# Altium project PSLink_v1.PrjPcb (part 1 of 3)
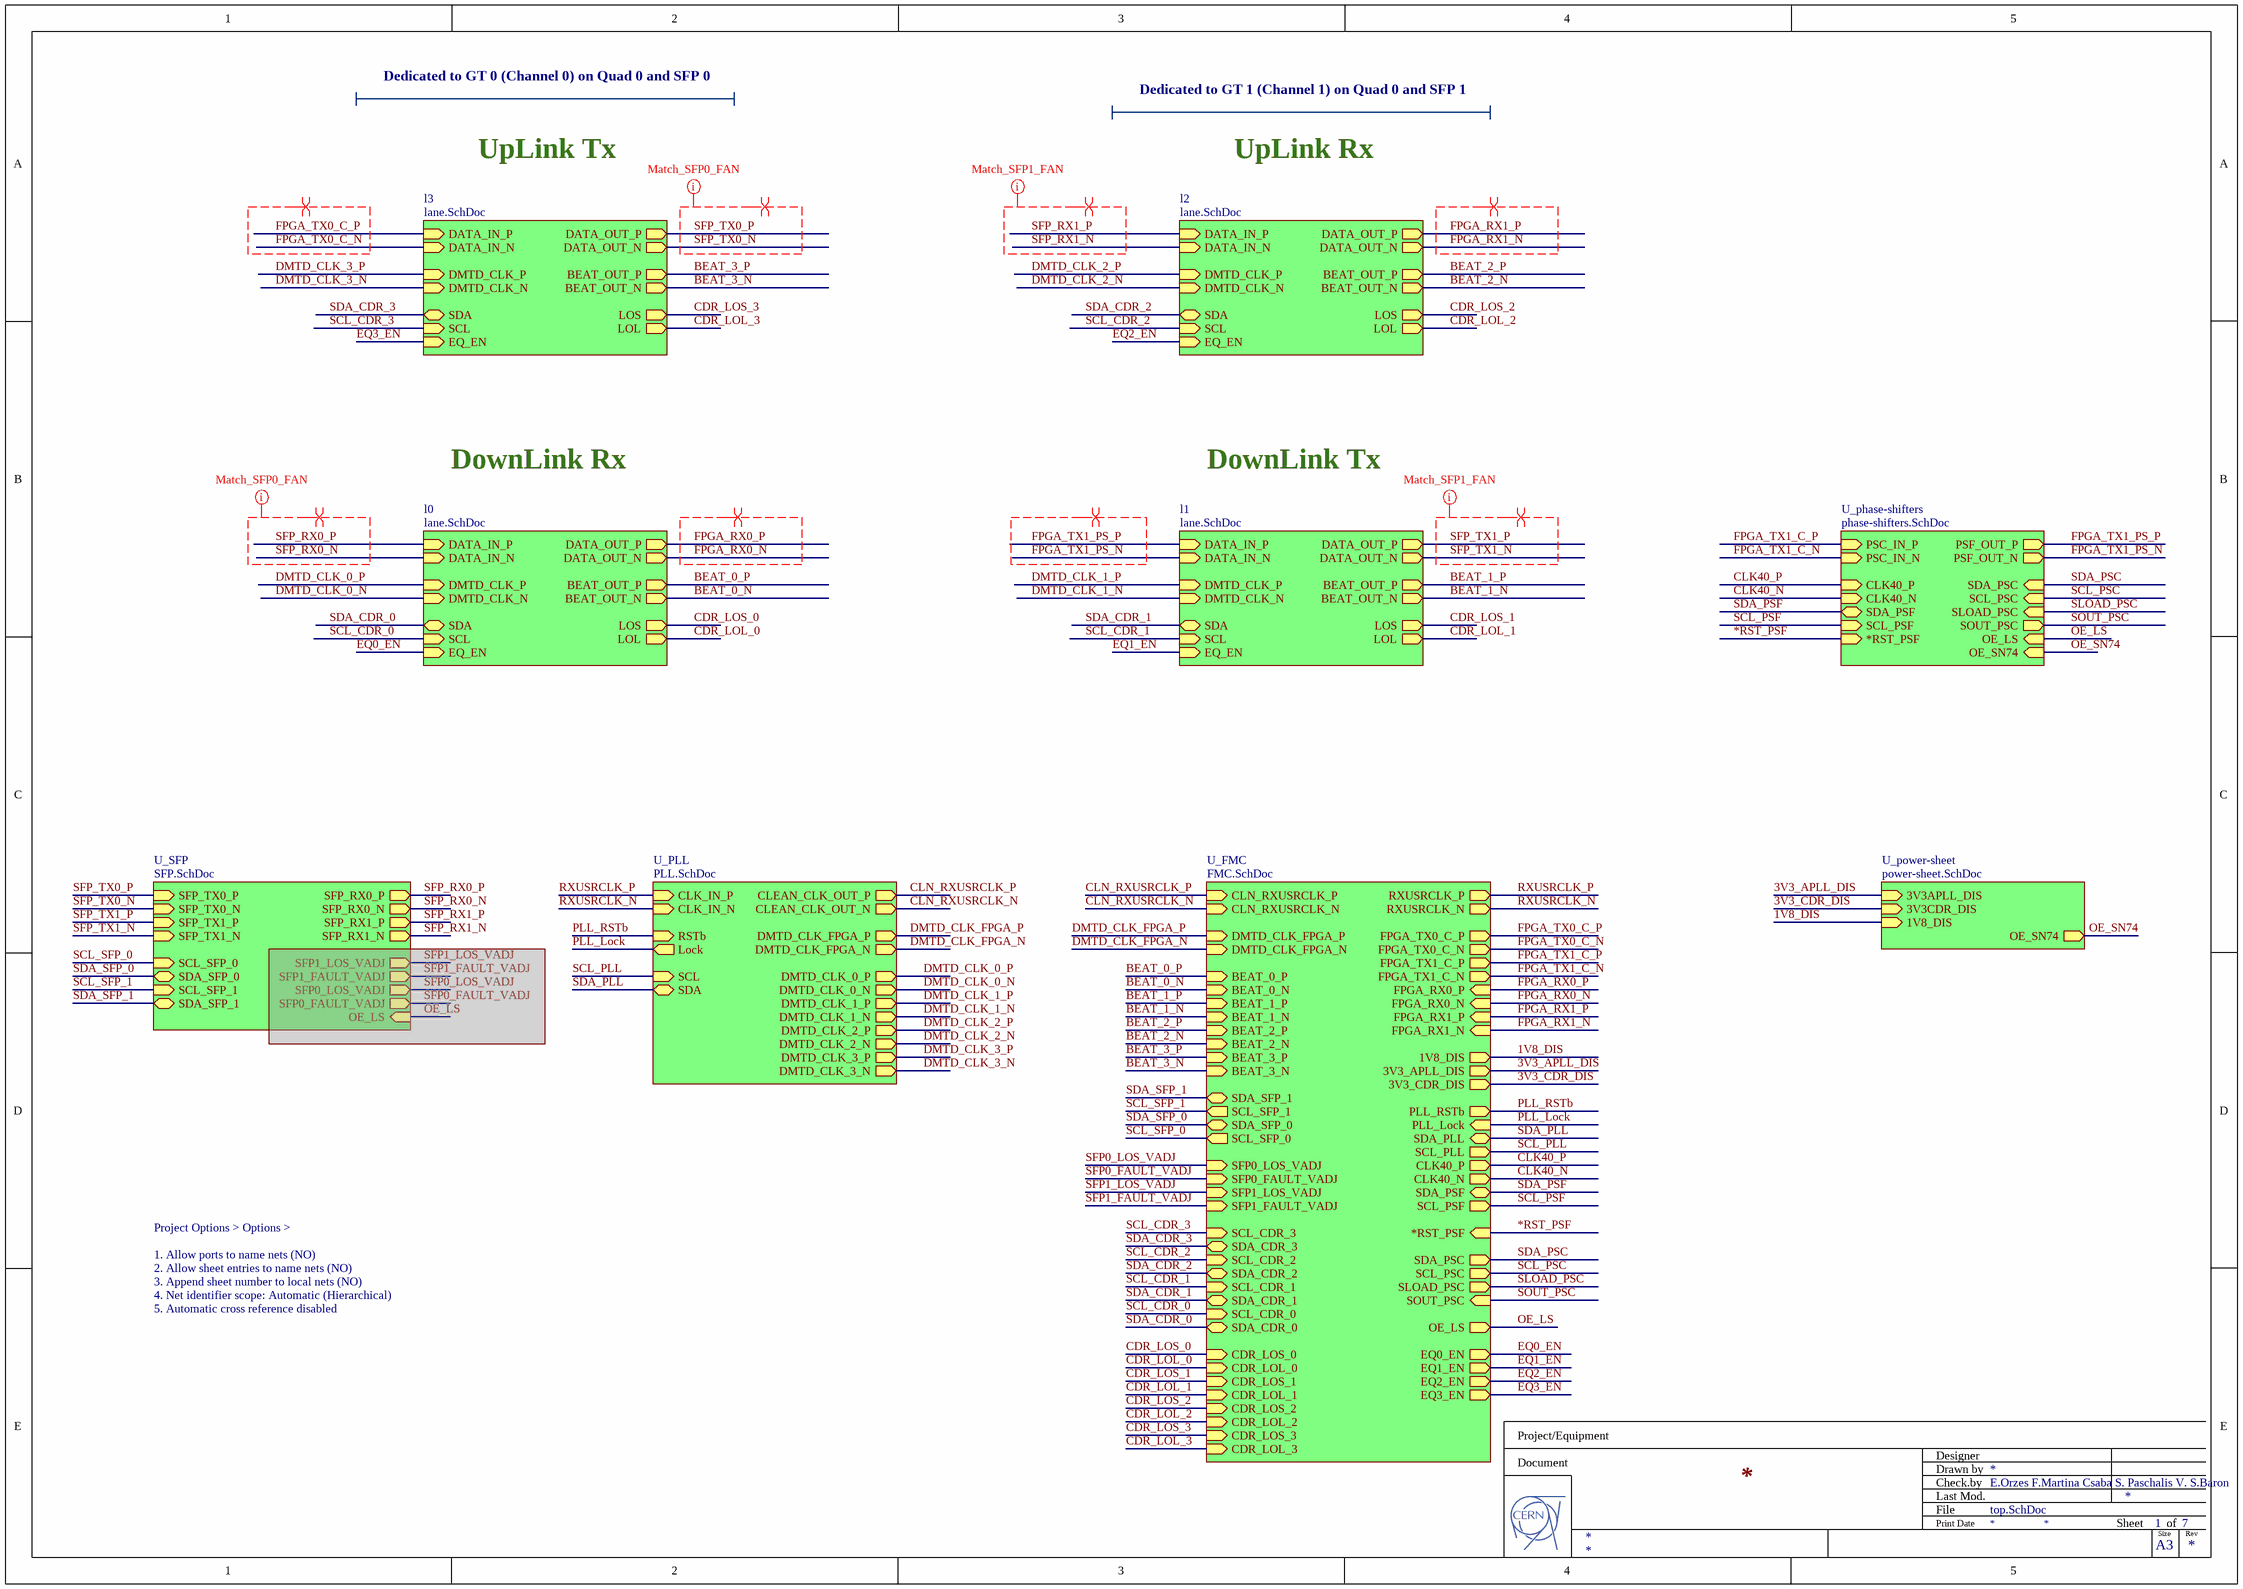
[diagram p0: top.SchDoc]
checkedby: E.Orzes F.Martina Csaba S. Paschalis V. S.Baron; Board_Revision: 1.0
7 sheets, 464 parts. Net scope: hierarchical (ports join the sheet entries above them; power ports are global).
Board file: PCB.PcbDoc
Sheets:
  top.SchDoc
    l3 = lane.SchDoc
    l2 = lane.SchDoc
    l1 = lane.SchDoc
    l0 = lane.SchDoc
    U_power-sheet = power-sheet.SchDoc
    U_phase-shifters = phase-shifters.SchDoc
    U_SFP = SFP.SchDoc
    U_PLL = PLL.SchDoc
    U_FMC = FMC.SchDoc

## Sheet top.SchDoc
size 420 x 297 mm; SheetNumber: 1; SheetTotal: 7

### Sub-sheets
l0 = lane.SchDoc: DATA_IN_P (in), DATA_IN_N (in), BEAT_OUT_P (out), BEAT_OUT_N (out), DMTD_CLK_P (in), DMTD_CLK_N (in), DATA_OUT_P (out), DATA_OUT_N (out), LOS (out), LOL (out), SDA (bidir), SCL (in), EQ_EN (in)
l1 = lane.SchDoc: DATA_IN_P (in), DATA_IN_N (in), BEAT_OUT_P (out), BEAT_OUT_N (out), DMTD_CLK_P (in), DMTD_CLK_N (in), DATA_OUT_P (out), DATA_OUT_N (out), LOS (out), LOL (out), SDA (bidir), SCL (in), EQ_EN (in)
l2 = lane.SchDoc: DATA_IN_P (in), DATA_IN_N (in), BEAT_OUT_P (out), BEAT_OUT_N (out), DMTD_CLK_P (in), DMTD_CLK_N (in), DATA_OUT_P (out), DATA_OUT_N (out), LOS (out), LOL (out), SDA (bidir), SCL (in), EQ_EN (in)
l3 = lane.SchDoc: DATA_IN_P (in), DATA_IN_N (in), BEAT_OUT_P (out), BEAT_OUT_N (out), DMTD_CLK_P (in), DMTD_CLK_N (in), DATA_OUT_P (out), DATA_OUT_N (out), LOS (out), LOL (out), SDA (bidir), SCL (in), EQ_EN (in)
U_FMC = FMC.SchDoc: DMTD_CLK_FPGA_N (in), DMTD_CLK_FPGA_P (in), BEAT_3_P (in), BEAT_3_N (in), SCL_PLL (out), SDA_PLL (bidir), SCL_SFP_1 (out), SDA_SFP_1 (bidir), SCL_SFP_0 (out), SDA_SFP_0 (bidir), PLL_Lock (in), SFP0_LOS_VADJ (in), SFP0_FAULT_VADJ (in), SFP1_LOS_VADJ (in), SFP1_FAULT_VADJ (in), CLN_RXUSRCLK_P (in), CLN_RXUSRCLK_N (in), RXUSRCLK_P (out), RXUSRCLK_N (out), PLL_RSTb (out), 1V8_DIS (out), 3V3_APLL_DIS (out), 3V3_CDR_DIS (out), FPGA_TX0_C_P (out), FPGA_TX0_C_N (out), FPGA_TX1_C_P (out), FPGA_TX1_C_N (out), FPGA_RX0_P (in), FPGA_RX0_N (in), FPGA_RX1_P (in), FPGA_RX1_N (in), BEAT_0_P (in), BEAT_0_N (in), BEAT_1_P (in), BEAT_1_N (in), BEAT_2_P (in), BEAT_2_N (in), CLK40_P (out), CLK40_N (out), SDA_PSF (bidir), SCL_PSF (out), CDR_LOS_1 (in), CDR_LOL_1 (in), CDR_LOS_0 (in), CDR_LOL_0 (in), CDR_LOS_3 (in), CDR_LOL_3 (in), CDR_LOS_2 (in), CDR_LOL_2 (in), *RST_PSF (in), SDA_PSC (out), SCL_PSC (out), SLOAD_PSC (out), SOUT_PSC (in), SCL_CDR_2 (in), SDA_CDR_2 (bidir), SCL_CDR_3 (in), SDA_CDR_3 (bidir), SDA_CDR_0 (bidir), SCL_CDR_1 (in), SDA_CDR_1 (bidir), SCL_CDR_0 (in), OE_LS (out), EQ0_EN (out), EQ1_EN (out), EQ2_EN (out), EQ3_EN (out)
U_phase-shifters = phase-shifters.SchDoc: PSC_IN_P (in), PSC_IN_N (in), PSF_OUT_P (out), PSF_OUT_N (out), CLK40_P (in), CLK40_N (in), SDA_PSF (bidir), SCL_PSF (in), *RST_PSF (in), SLOAD_PSC (in), SCL_PSC (in), SDA_PSC (in), SOUT_PSC (out), OE_LS (in), OE_SN74 (in)
U_PLL = PLL.SchDoc: SCL (in), SDA (bidir), CLK_IN_P (in), CLK_IN_N (in), CLEAN_CLK_OUT_P (out), CLEAN_CLK_OUT_N (out), DMTD_CLK_0_P (out), DMTD_CLK_0_N (out), DMTD_CLK_1_P (out), DMTD_CLK_1_N (out), DMTD_CLK_2_P (out), DMTD_CLK_2_N (out), DMTD_CLK_FPGA_P (out), DMTD_CLK_FPGA_N (out), DMTD_CLK_3_P (out), DMTD_CLK_3_N (out), Lock (out), RSTb (in)
U_power-sheet = power-sheet.SchDoc: 3V3APLL_DIS (in), 3V3CDR_DIS (in), 1V8_DIS (in), OE_SN74 (out)
U_SFP = SFP.SchDoc: SFP_RX0_P (out), SFP_RX0_N (out), SFP_TX0_P (in), SFP_TX0_N (in), SFP_RX1_P (out), SFP_RX1_N (out), SFP_TX1_P (in), SFP_TX1_N (in), SCL_SFP_0 (in), SDA_SFP_0 (bidir), SCL_SFP_1 (in), SDA_SFP_1 (bidir), SFP1_LOS_VADJ (out), SFP1_FAULT_VADJ (out), SFP0_LOS_VADJ (out), SFP0_FAULT_VADJ (out), OE_LS (in)

### Nets
1V8_DIS: sheet U_power-sheet/1V8_DIS, sheet U_FMC/1V8_DIS
3V3_APLL_DIS: sheet U_power-sheet/3V3APLL_DIS, sheet U_FMC/3V3_APLL_DIS
3V3_CDR_DIS: sheet U_power-sheet/3V3CDR_DIS, sheet U_FMC/3V3_CDR_DIS
*RST_PSF: sheet U_phase-shifters/*RST_PSF, sheet U_FMC/*RST_PSF
BEAT_0_N: sheet l0/BEAT_OUT_N, sheet U_FMC/BEAT_0_N
BEAT_0_P: sheet l0/BEAT_OUT_P, sheet U_FMC/BEAT_0_P
BEAT_1_N: sheet l1/BEAT_OUT_N, sheet U_FMC/BEAT_1_N
BEAT_1_P: sheet l1/BEAT_OUT_P, sheet U_FMC/BEAT_1_P
BEAT_2_N: sheet l2/BEAT_OUT_N, sheet U_FMC/BEAT_2_N
BEAT_2_P: sheet l2/BEAT_OUT_P, sheet U_FMC/BEAT_2_P
BEAT_3_N: sheet l3/BEAT_OUT_N, sheet U_FMC/BEAT_3_N
BEAT_3_P: sheet l3/BEAT_OUT_P, sheet U_FMC/BEAT_3_P
CDR_LOL_0: sheet l0/LOL, sheet U_FMC/CDR_LOL_0
CDR_LOL_1: sheet l1/LOL, sheet U_FMC/CDR_LOL_1
CDR_LOL_2: sheet l2/LOL, sheet U_FMC/CDR_LOL_2
CDR_LOL_3: sheet l3/LOL, sheet U_FMC/CDR_LOL_3
CDR_LOS_0: sheet l0/LOS, sheet U_FMC/CDR_LOS_0
CDR_LOS_1: sheet l1/LOS, sheet U_FMC/CDR_LOS_1
CDR_LOS_2: sheet l2/LOS, sheet U_FMC/CDR_LOS_2
CDR_LOS_3: sheet l3/LOS, sheet U_FMC/CDR_LOS_3
CLK40_N: sheet U_phase-shifters/CLK40_N, sheet U_FMC/CLK40_N
CLK40_P: sheet U_phase-shifters/CLK40_P, sheet U_FMC/CLK40_P
CLN_RXUSRCLK_N: sheet U_PLL/CLEAN_CLK_OUT_N, sheet U_FMC/CLN_RXUSRCLK_N
CLN_RXUSRCLK_P: sheet U_PLL/CLEAN_CLK_OUT_P, sheet U_FMC/CLN_RXUSRCLK_P
DMTD_CLK_0_N: sheet l0/DMTD_CLK_N, sheet U_PLL/DMTD_CLK_0_N
DMTD_CLK_0_P: sheet l0/DMTD_CLK_P, sheet U_PLL/DMTD_CLK_0_P
DMTD_CLK_1_N: sheet l1/DMTD_CLK_N, sheet U_PLL/DMTD_CLK_1_N
DMTD_CLK_1_P: sheet l1/DMTD_CLK_P, sheet U_PLL/DMTD_CLK_1_P
DMTD_CLK_2_N: sheet l2/DMTD_CLK_N, sheet U_PLL/DMTD_CLK_2_N
DMTD_CLK_2_P: sheet l2/DMTD_CLK_P, sheet U_PLL/DMTD_CLK_2_P
DMTD_CLK_3_N: sheet l3/DMTD_CLK_N, sheet U_PLL/DMTD_CLK_3_N
DMTD_CLK_3_P: sheet l3/DMTD_CLK_P, sheet U_PLL/DMTD_CLK_3_P
DMTD_CLK_FPGA_N: sheet U_PLL/DMTD_CLK_FPGA_N, sheet U_FMC/DMTD_CLK_FPGA_N
DMTD_CLK_FPGA_P: sheet U_PLL/DMTD_CLK_FPGA_P, sheet U_FMC/DMTD_CLK_FPGA_P
EQ0_EN: sheet l0/EQ_EN, sheet U_FMC/EQ0_EN
EQ1_EN: sheet l1/EQ_EN, sheet U_FMC/EQ1_EN
EQ2_EN: sheet l2/EQ_EN, sheet U_FMC/EQ2_EN
EQ3_EN: sheet l3/EQ_EN, sheet U_FMC/EQ3_EN
FPGA_RX0_N: sheet l0/DATA_OUT_N, sheet U_FMC/FPGA_RX0_N
FPGA_RX0_P: sheet l0/DATA_OUT_P, sheet U_FMC/FPGA_RX0_P
FPGA_RX1_N: sheet l2/DATA_OUT_N, sheet U_FMC/FPGA_RX1_N
FPGA_RX1_P: sheet l2/DATA_OUT_P, sheet U_FMC/FPGA_RX1_P
FPGA_TX0_C_N: sheet l3/DATA_IN_N, sheet U_FMC/FPGA_TX0_C_N
FPGA_TX0_C_P: sheet l3/DATA_IN_P, sheet U_FMC/FPGA_TX0_C_P
FPGA_TX1_C_N: sheet U_phase-shifters/PSC_IN_N, sheet U_FMC/FPGA_TX1_C_N
FPGA_TX1_C_P: sheet U_phase-shifters/PSC_IN_P, sheet U_FMC/FPGA_TX1_C_P
FPGA_TX1_PS_N: sheet l1/DATA_IN_N, sheet U_phase-shifters/PSF_OUT_N
FPGA_TX1_PS_P: sheet l1/DATA_IN_P, sheet U_phase-shifters/PSF_OUT_P
OE_LS: sheet U_phase-shifters/OE_LS, sheet U_FMC/OE_LS
OE_SN74: sheet U_power-sheet/OE_SN74, sheet U_phase-shifters/OE_SN74
PLL_Lock: sheet U_PLL/Lock, sheet U_FMC/PLL_Lock
PLL_RSTb: sheet U_PLL/RSTb, sheet U_FMC/PLL_RSTb
RXUSRCLK_N: sheet U_PLL/CLK_IN_N, sheet U_FMC/RXUSRCLK_N
RXUSRCLK_P: sheet U_PLL/CLK_IN_P, sheet U_FMC/RXUSRCLK_P
SCL_CDR_0: sheet l0/SCL, sheet U_FMC/SCL_CDR_0
SCL_CDR_1: sheet l1/SCL, sheet U_FMC/SCL_CDR_1
SCL_CDR_2: sheet l2/SCL, sheet U_FMC/SCL_CDR_2
SCL_CDR_3: sheet l3/SCL, sheet U_FMC/SCL_CDR_3
SCL_PLL: sheet U_PLL/SCL, sheet U_FMC/SCL_PLL
SCL_PSC: sheet U_phase-shifters/SCL_PSC, sheet U_FMC/SCL_PSC
SCL_PSF: sheet U_phase-shifters/SCL_PSF, sheet U_FMC/SCL_PSF
SCL_SFP_0: sheet U_SFP/SCL_SFP_0, sheet U_FMC/SCL_SFP_0  [project net SCL0]
SCL_SFP_1: sheet U_SFP/SCL_SFP_1, sheet U_FMC/SCL_SFP_1  [project net SCL1]
SDA_CDR_0: sheet l0/SDA, sheet U_FMC/SDA_CDR_0
SDA_CDR_1: sheet l1/SDA, sheet U_FMC/SDA_CDR_1
SDA_CDR_2: sheet l2/SDA, sheet U_FMC/SDA_CDR_2
SDA_CDR_3: sheet l3/SDA, sheet U_FMC/SDA_CDR_3
SDA_PLL: sheet U_PLL/SDA, sheet U_FMC/SDA_PLL
SDA_PSC: sheet U_phase-shifters/SDA_PSC, sheet U_FMC/SDA_PSC
SDA_PSF: sheet U_phase-shifters/SDA_PSF, sheet U_FMC/SDA_PSF
SDA_SFP_0: sheet U_SFP/SDA_SFP_0, sheet U_FMC/SDA_SFP_0  [project net SDA0]
SDA_SFP_1: sheet U_SFP/SDA_SFP_1, sheet U_FMC/SDA_SFP_1  [project net SDA1]
SFP0_FAULT_VADJ: sheet U_FMC/SFP0_FAULT_VADJ
SFP0_LOS_VADJ: sheet U_FMC/SFP0_LOS_VADJ
SFP1_FAULT_VADJ: sheet U_FMC/SFP1_FAULT_VADJ
SFP1_LOS_VADJ: sheet U_FMC/SFP1_LOS_VADJ
SFP_RX0_N: sheet l0/DATA_IN_N, sheet U_SFP/SFP_RX0_N
SFP_RX0_P: sheet l0/DATA_IN_P, sheet U_SFP/SFP_RX0_P
SFP_RX1_N: sheet l2/DATA_IN_N, sheet U_SFP/SFP_RX1_N
SFP_RX1_P: sheet l2/DATA_IN_P, sheet U_SFP/SFP_RX1_P
SFP_TX0_N: sheet l3/DATA_OUT_N, sheet U_SFP/SFP_TX0_N
SFP_TX0_P: sheet l3/DATA_OUT_P, sheet U_SFP/SFP_TX0_P
SFP_TX1_N: sheet l1/DATA_OUT_N, sheet U_SFP/SFP_TX1_N
SFP_TX1_P: sheet l1/DATA_OUT_P, sheet U_SFP/SFP_TX1_P
SLOAD_PSC: sheet U_phase-shifters/SLOAD_PSC, sheet U_FMC/SLOAD_PSC
SOUT_PSC: sheet U_phase-shifters/SOUT_PSC, sheet U_FMC/SOUT_PSC

### Layout directives
differential pair: FPGA_RX0_N, FPGA_RX0_P, FPGA_RX1_N, FPGA_RX1_P, FPGA_TX0_C_N, FPGA_TX0_C_P, FPGA_TX1_PS_N, FPGA_TX1_PS_P, SFP_RX0_N, SFP_RX0_P, SFP_RX1_N, SFP_RX1_P, SFP_TX0_N, SFP_TX0_P, SFP_TX1_N, SFP_TX1_P
net class Match_SFP0_FAN: SFP_RX0_N, SFP_RX0_P, SFP_TX0_N, SFP_TX0_P
net class Match_SFP1_FAN: SFP_RX1_N, SFP_RX1_P, SFP_TX1_N, SFP_TX1_P

### Notes on the sheet
- Dedicated to GT 0 (Channel 0) on Quad 0 and SFP 0
- Dedicated to GT 1 (Channel 1) on Quad 0 and SFP 1
- UpLink Tx
- UpLink Rx
- DownLink Rx
- DownLink Tx
- Project Options > Options >
  1. Allow ports to name nets (NO)
  2. Allow sheet entries to name nets (NO)
  3. Append sheet number to local nets (NO)
  4. Net identifier scope: Automatic (Hierarchical)
  5. Automatic cross reference disabled
- Project/Equipment
- Document
- Designer
- Drawn by
- Check.by
- File
- Last Mod.
- Print Date
- Sheet
- Size
- A3
- of
- Rev

## Sheet lane.SchDoc: Lane
size 420 x 297 mm; CheckedBy: E.Orzes F.Martina Csaba S. Paschalis V. S.Baron; CompanyName: CERN; DrawnBy: E.Orzes; Organization: CERN; Address1: European Organization for Nuclear Research; Address2: CH-1211 Genève 23 - Switzerland; Revision: 1.0; SheetNumber: 2; SheetTotal: 7; Projet: PSLink_t1; DivGrp: EP-ESE; Designer: E.Orzes; ModifiedDate: -
Used 4 times, as channels l3, l2, l1, l0. Parts and nets are listed once, with the designators drawn on the sheet.
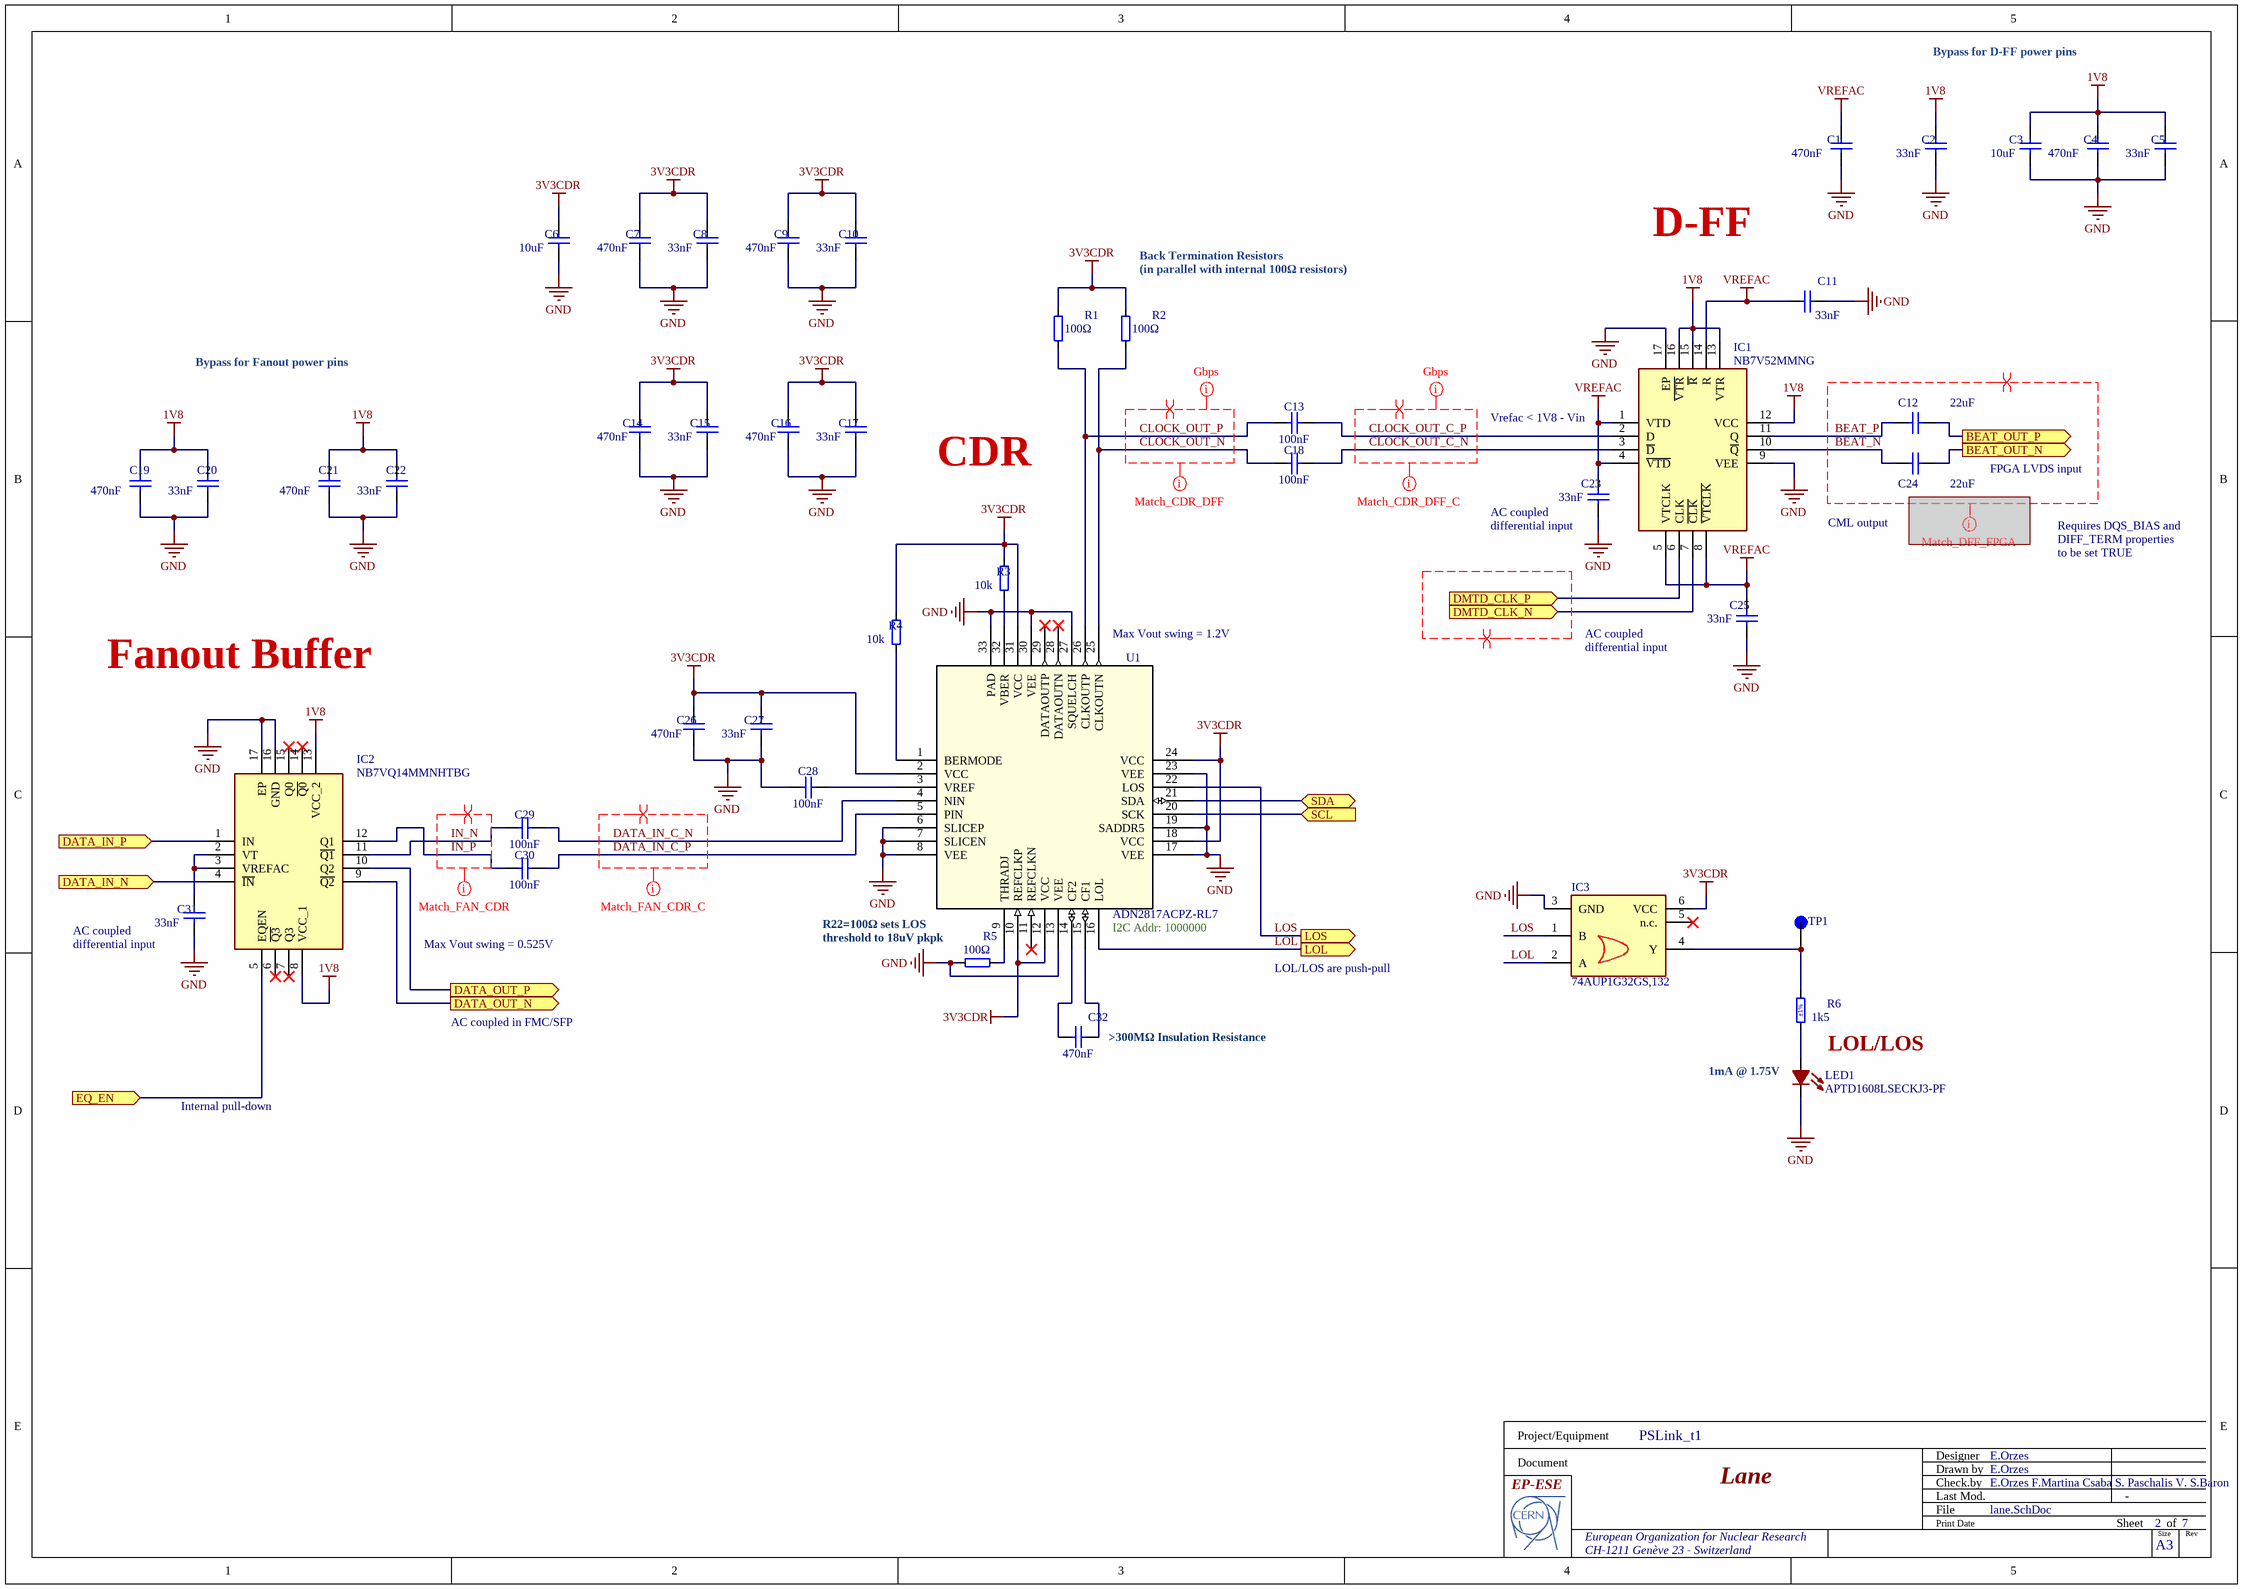
[diagram p1: lane.SchDoc]

### Parts
C1  470nF  [CAPC0510X04N]
C2  33nF  [LLL03TR61E333KE01]
C3  10uF  [CAPC1608X87N]
C4  470nF  [CAPC0510X04N]
C5  33nF  [LLL03TR61E333KE01]
C6  10uF  [CAPC1608X87N]
C7  470nF  [CAPC0510X04N]
C8  33nF  [LLL03TR61E333KE01]
C9  470nF  [CAPC0510X04N]
C10  33nF  [LLL03TR61E333KE01]
C11  33nF  [LLL03TR61E333KE01]
C12  22uF  [MURATA_HI_DENSITY_0402_CAP]
C13  100nF  [MURATA_HI_DENSITY_0201]
C14  470nF  [CAPC0510X04N]
C15  33nF  [LLL03TR61E333KE01]
C16  470nF  [CAPC0510X04N]
C17  33nF  [LLL03TR61E333KE01]
C18  100nF  [MURATA_HI_DENSITY_0201]
C19  470nF  [CAPC0510X04N]
C20  33nF  [LLL03TR61E333KE01]
C21  470nF  [CAPC0510X04N]
C22  33nF  [LLL03TR61E333KE01]
C23  33nF  [LLL03TR61E333KE01]
C24  22uF  [MURATA_HI_DENSITY_0402_CAP]
C25  33nF  [LLL03TR61E333KE01]
C26  470nF  [CAPC0510X04N]
C27  33nF  [LLL03TR61E333KE01]
C28  100nF  [MURATA_HI_DENSITY_0201]
C29  100nF  [MURATA_HI_DENSITY_0201]
C30  100nF  [MURATA_HI_DENSITY_0201]
C31  33nF  [LLL03TR61E333KE01]
C32  470nF  [CAPC2013X140N]
IC1  NB7V52MMNG  [QFN50P300X300X100-17N]
IC2  NB7VQ14MMNHTBG  [QFN50P300X300X100-17N]
IC3  74AUP1G32GS,132  [74LVC1G3157GS132]
LED1  APTD1608LSECKJ3-PF  [LED_APTD1608LSECKJ3-PF_KNB]
R1  100Ω  [MURATA_HI_DENSITY_0201]
R2  100Ω  [MURATA_HI_DENSITY_0201]
R3  10k  [MURATA_HI_DENSITY_0201]
R4  10k  [MURATA_HI_DENSITY_0201]
R5  100Ω  [MURATA_HI_DENSITY_0201]
R6  1k5  Tolerance: ±1%  [RESC1005X40N]
TP1  RCU-0C  [TP+195X110]  (value not drawn)
U1  ADN2817ACPZ-RL7  [CP_32_11_ADI]

### Ports
BEAT_OUT_N (out), BEAT_OUT_P (out), DATA_IN_N (in), DATA_IN_P (in), DATA_OUT_N (out), DATA_OUT_P (out), DMTD_CLK_N (in), DMTD_CLK_P (in), EQ_EN (in), LOL (out), LOS (out), SCL (in), SDA (bidir)

### Nets
1V8: C2.2 C3.2 C4.2 C5.2 C19.2 C20.2 C21.2 C22.2 IC1.12(VCC) IC1.13(VTR) IC1.15(~{R}) IC1.16(~{VTR}) IC2.8(VCC_1) IC2.13(VCC_2)
3V3CDR: C6.2 C7.2 C8.2 C9.2 C10.2 C14.2 C15.2 C16.2 C17.2 C26.2 C27.2 IC3.6(VCC) R1.2 R2.2 R3.2 R4.2 U1.2(VCC) U1.10(REFCLKP) U1.12(VCC) U1.18(VCC) U1.24(VCC) U1.31(VCC)
GND: C1.1 C2.1 C3.1 C4.1 C5.1 C6.1 C7.1 C8.1 C9.1 C10.1 C11.1 C14.1 C15.1 C16.1 C17.1 C19.1 C20.1 C21.1 C22.1 C23.1 C25.1 C26.1 C27.1 C28.1 C31.1 IC1.9(VEE) IC1.17(EP) IC2.16(GND) IC2.17(EP) IC3.3(GND) LED1.1(C) R5.1 U1.6(SLICEP) U1.7(SLICEN) U1.8(VEE) U1.13(VEE) U1.17(VEE) U1.19(SADDR5) U1.23(VEE) U1.27(SQUELCH) U1.30(VEE) U1.33(PAD)
VREFAC: C1.2 C11.2 C23.2 C25.2 IC1.1(VTD) IC1.4(~{VTD}) IC1.5(VTCLK) IC1.8(~{VTCLK}) IC1.14(R)
BEAT_N: C24.2 IC1.10(~{Q})
BEAT_OUT_N: C24.1 ; port BEAT_OUT_N
BEAT_OUT_P: C12.1 ; port BEAT_OUT_P
BEAT_P: C12.2 IC1.11(Q)
CLOCK_OUT_C_N: C18.2 IC1.3(~{D})
CLOCK_OUT_C_P: C13.2 IC1.2(D)
CLOCK_OUT_N: C18.1 R2.1 U1.25(CLKOUTN)
CLOCK_OUT_P: C13.1 R1.1 U1.26(CLKOUTP)
DATA_IN_C_N: C29.2 U1.4(NIN)
DATA_IN_C_P: C30.2 U1.5(PIN)
DATA_IN_N: IC2.4(~{IN}) ; port DATA_IN_N
DATA_IN_P: IC2.1(IN) ; port DATA_IN_P
DATA_OUT_N: IC2.9(~{Q2}) ; port DATA_OUT_N
DATA_OUT_P: IC2.10(Q2) ; port DATA_OUT_P
DMTD_CLK_N: IC1.7(~{CLK}) ; port DMTD_CLK_N
DMTD_CLK_P: IC1.6(CLK) ; port DMTD_CLK_P
EQ_EN: IC2.5(EQEN) ; port EQ_EN
IN_N: C29.1 IC2.11(~{Q1})
IN_P: C30.1 IC2.12(Q1)
LOL: IC3.2(A) U1.16(LOL) ; port LOL
LOS: IC3.1(B) U1.22(LOS) ; port LOS
SCL: U1.20(SCK) ; port SCL
SDA: U1.21(SDA) ; port SDA
NetC28_2: C28.2 U1.3(VREF)
NetC31_2: C31.2 IC2.2(VT) IC2.3(VREFAC)
NetC32_1: C32.1 U1.14(CF2)
NetC32_2: C32.2 U1.15(CF1)
NetIC3_4: IC3.4(Y) R6.2 TP1.1(TP)
NetLED1_2: LED1.2(A) R6.1
NetR3_1: R3.1 U1.32(VBER)
NetR4_1: R4.1 U1.1(BERMODE)
NetR5_2: R5.2 U1.9(THRADJ)

Not connected (* = marked no-connect by the designer): IC2 6(~{Q3})* 7(Q3)* 14(~{Q0})* 15(Q0)*; IC3 5(n.c.)*; U1 11(REFCLKN)* 28(DATAOUTN)* 29(DATAOUTP)*

### Channels
l3: designators end in _l3; ports BEAT_OUT_N=BEAT_3_N BEAT_OUT_P=BEAT_3_P DATA_IN_N=FPGA_TX0_C_N DATA_IN_P=FPGA_TX0_C_P DATA_OUT_N=SFP_TX0_N DATA_OUT_P=SFP_TX0_P DMTD_CLK_N=DMTD_CLK_3_N DMTD_CLK_P=DMTD_CLK_3_P EQ_EN=EQ3_EN LOL=CDR_LOL_3 LOS=CDR_LOS_3 SCL=SCL_CDR_3 SDA=SDA_CDR_3
l2: designators end in _l2; ports BEAT_OUT_N=BEAT_2_N BEAT_OUT_P=BEAT_2_P DATA_IN_N=SFP_RX1_N DATA_IN_P=SFP_RX1_P DATA_OUT_N=FPGA_RX1_N DATA_OUT_P=FPGA_RX1_P DMTD_CLK_N=DMTD_CLK_2_N DMTD_CLK_P=DMTD_CLK_2_P EQ_EN=EQ2_EN LOL=CDR_LOL_2 LOS=CDR_LOS_2 SCL=SCL_CDR_2 SDA=SDA_CDR_2
l1: designators end in _l1; ports BEAT_OUT_N=BEAT_1_N BEAT_OUT_P=BEAT_1_P DATA_IN_N=FPGA_TX1_PS_N DATA_IN_P=FPGA_TX1_PS_P DATA_OUT_N=SFP_TX1_N DATA_OUT_P=SFP_TX1_P DMTD_CLK_N=DMTD_CLK_1_N DMTD_CLK_P=DMTD_CLK_1_P EQ_EN=EQ1_EN LOL=CDR_LOL_1 LOS=CDR_LOS_1 SCL=SCL_CDR_1 SDA=SDA_CDR_1
l0: designators end in _l0; ports BEAT_OUT_N=BEAT_0_N BEAT_OUT_P=BEAT_0_P DATA_IN_N=SFP_RX0_N DATA_IN_P=SFP_RX0_P DATA_OUT_N=FPGA_RX0_N DATA_OUT_P=FPGA_RX0_P DMTD_CLK_N=DMTD_CLK_0_N DMTD_CLK_P=DMTD_CLK_0_P EQ_EN=EQ0_EN LOL=CDR_LOL_0 LOS=CDR_LOS_0 SCL=SCL_CDR_0 SDA=SDA_CDR_0

### Layout directives
differential pair: (no net found under the mark), BEAT_N, BEAT_P, CLOCK_OUT_C_N, CLOCK_OUT_C_P, CLOCK_OUT_N, CLOCK_OUT_P, DATA_IN_C_N, DATA_IN_C_P, IN_N, IN_P
net class Match_DFF_FPGA: BEAT_N, BEAT_P
mark named Gbps: CLOCK_OUT_C_N, CLOCK_OUT_C_P, CLOCK_OUT_N, CLOCK_OUT_P
net class Match_CDR_DFF: CLOCK_OUT_N, CLOCK_OUT_P
net class Match_FAN_CDR_C: DATA_IN_C_N, DATA_IN_C_P
net class Match_FAN_CDR: IN_N, IN_P
net class Match_CDR_DFF_C: CLOCK_OUT_C_N, CLOCK_OUT_C_P

### Notes on the sheet
- Bypass for D-FF power pins
- D-FF
- (near R2) Back Termination Resistors
  (in parallel with internal 100Ω resistors)
- Bypass for Fanout power pins
- Vrefac < 1V8 - Vin swing/2
- CDR
- (near C23) AC coupled
  differential input
- CML output
- FPGA LVDS input
- Requires DQS_BIAS and DIFF_TERM properties to be set TRUE
- (near U1) Max Vout swing = 1.2V
- AC coupled
  differential input
- Fanout Buffer
- (near U1) R22=100Ω sets LOS threshold to 18uV pkpk
- (near U1) I2C Addr: 1000000
- (near C31) AC coupled
  differential input
- Max Vout swing = 0.525V
- LOL/LOS are push-pull
- AC coupled in FMC/SFP
- (near C32) >300MΩ Insulation Resistance
- (near LED1) 1mA @ 1.75V
- LOL/LOS
- Internal pull-down
- Project/Equipment
- Document
- Designer
- Drawn by
- Check.by
- File
- Last Mod.
- Print Date
- Sheet
- Size
- A3
- of
- Rev

### Library data of the parts
C1 C4 C7 C9 C14 C16 C19 C21 C26 = Capacitor - non polarized: LLL153C70G474ME17; Value: 470nF
C2 C5 C8 C10 C11 C15 C17 C20 C22 C23 C25 C27 C31 = Capacitor - non polarized: LLL03TR61E333KE01; Value: 33nF
C3 C6 = CC0603_10UF_6.3V_20%_X5R: C1608X5R1E106M080AC; Part Description: SMD Multilayer Chip Ceramic Capacitor; Manufacturer: GENERIC; Manufacturer1 Part Number: C0603C106M9PAC; Voltage: 6.3V; TC: X5R; Tolerance: ±20%; Part Number: CC0603_10UF_6.3V_20%_X5R; Component Kind: Standard; Component Type: Standard; Pin Count: 2; Value: 10uF; Status: Preferred; Manufacturer Part Number: CC0603_10uF_6.3V_20%_X5R; Case: 0603; Mounted: Yes; Socket: No; SMD: Yes; Sense: No; Manufacturer1 Example: KEMET; Manufacturer1 ComponentHeight: 0.95mm; HelpURL: \\cern.ch\dfs\Applications\Altium\Datasheets\CC0603_X5R_KEMET.pdf; Author: CERN DEM JLC; CreateDate: 03/12/2007; LatestRevisionDate: 03/12/2007
C12 C24 = C0402-22uF-high-density: GRM155R60J226ME11; Vmax: 6.3V; Value: 22uF
C13 C18 C28-C30 = C0201-100nF-high-density: GRM033R61C104KE14; Vmax: 16V; Value: 100nF
C32 = CC0805_470NF_50V_10%_X7R_MURATA_GCM21BR71H474KA55L: GCM21BR71H474KA55L; Part Description: SMD Chip Monolithic Ceramic Capacitor for Automotive; Manufacturer: MURATA; Voltage: 50V; TC: X7R; Tolerance: ±10%; Part Number: CC0805_470NF_50V_10%_X7R_MURATA_GCM21BR71H474KA55L; Component Kind: Standard; Component Type: Standard; Pin Count: 2; Value: 470nF; Status: Not Recommended; Manufacturer Part Number: GCM21BR71H474KA55L; Case: 0805; Mounted: Yes; Socket: No; SMD: Yes; Sense: No; ComponentHeight: 1.4mm; HelpURL: \\cern.ch\dfs\Applications\Altium\Datasheets\CC0805_MURATA_GCM21BR71H474KA55L.pdf; Author: CERN DEM JLC; CreateDate: 5/10/2017; LatestRevisionDate: 5/10/2017
IC1 = NB7V52MMNG: Integrated Circuit; Manufacturer_Name: onsemi; Datasheet Link: https://www.onsemi.com/pdf/datasheet/nb7v52m-d.pdf; Height: 1mm; Manufacturer_Part_Number: NB7V52MMNG; Mouser Part Number: 863-NB7V52MMNG; Mouser Price/Stock: https://www.mouser.co.uk/ProductDetail/ON-Semiconductor/NB7V52MMNG?qs=N5dOQkml4H8i91m%252BmwlaUQ%3D%3D; Arrow Part Number: NB7V52MMNG; Arrow Price/Stock: https://www.arrow.com/en/products/nb7v52mmng/on-semiconductor
IC2 = NB7VQ14MMNHTBG: Integrated Circuit; Manufacturer_Name: onsemi; Datasheet Link: http://www.onsemi.com/pub/Collateral/NB7VQ14M-D.PDF; Height: 1mm; Manufacturer_Part_Number: NB7VQ14MMNHTBG; Mouser Part Number: 863-NB7VQ14MMNHTBG; Mouser Price/Stock: https://www.mouser.co.uk/ProductDetail/onsemi/NB7VQ14MMNHTBG?qs=3PKVEWFFm2%2FWq%2FFZ4xstfg%3D%3D; Arrow Part Number: NB7VQ14MMNHTBG; Arrow Price/Stock: https://www.arrow.com/en/products/nb7vq14mmnhtbg/on-semiconductor?utm_currency=USD&region=nac
IC3 = 74AUP1G32GS,132: Integrated Circuit; Manufacturer_Name: Nexperia; Datasheet Link: https://assets.nexperia.com/documents/data-sheet/74AUP1G32.pdf; Height: 0.35mm; Manufacturer_Part_Number: 74AUP1G32GS,132; Mouser Part Number: 771-74AUP1G32GS132; Mouser Price/Stock: https://www.mouser.com/Search/Refine.aspx?Keyword=771-74AUP1G32GS132
LED1 = APTD1608LSECKJ3-PF: Led Red 0603 2mA 1.8V 50mcd 84mW; Mfr_Name: Kingbright
R1 R2 R5 = R0201-100ohm-high-density: Resistor; Value: 100Ω
R3 R4 = R0201-100ohm-high-density: Resistor 10k; Value: 100Ω
R6 = R0402_1K5_1%_0.0625W_100PPM: Resistor - 1%; Part Description: General Purpose Thick Film Chip Resistor; Manufacturer: GENERIC; Manufacturer1 Part Number: 232270671502L; TC: ±100ppm/°C; PressFit: No; Part Number: R0402_1K5_1%_0.0625W_100PPM; Component Kind: Standard; Component Type: Standard; Pin Count: 2; Value: 1k5; Status: Not Recommended; Power: 0.0625W; Manufacturer Part Number: R0402_1K5_1%_0.0625W_100PPM; Case: 0402; Mounted: Yes; Sense: No; Socket: No; SMD: Yes; Manufacturer1 Example: YAGEO PHYCOMP; Manufacturer1 ComponentHeight: 0.4mm; HelpURL: \\cern.ch\dfs\Applications\Altium\Datasheets\R0402_Phycomp_RC0402.pdf; Author: CERN DEM JLC; CreateDate: 12/3/2007; LatestRevisionDate: 10/17/2012
TP1 = RCU-0C: MF: {'manufacturer': u'TE Connectivity AMP Connectors'}; Package: None; Price: None; Value: *; MP: RCU-0C; Availability: Unavailable
U1 = ADN2817ACPZ-RL7: CDR; Mfr_Name: Analog Devices Inc; RefDes: RefDes; Type: Type

## Sheet power-sheet.SchDoc: Power Regulator
size 420 x 297 mm; CheckedBy: E.Orzes F.Martina S.Baron; CompanyName: CERN; DrawnBy: E.Orzes; Organization: CERN; Address1: European Organization for Nuclear Research; Address2: CH-1211 Genève 23 - Switzerland; Revision: 1.0; SheetNumber: 7; SheetTotal: 7; Projet: Phase Stable Link; DivGrp: EP-ESE; Designer: E.Orzes; ModifiedDate: -
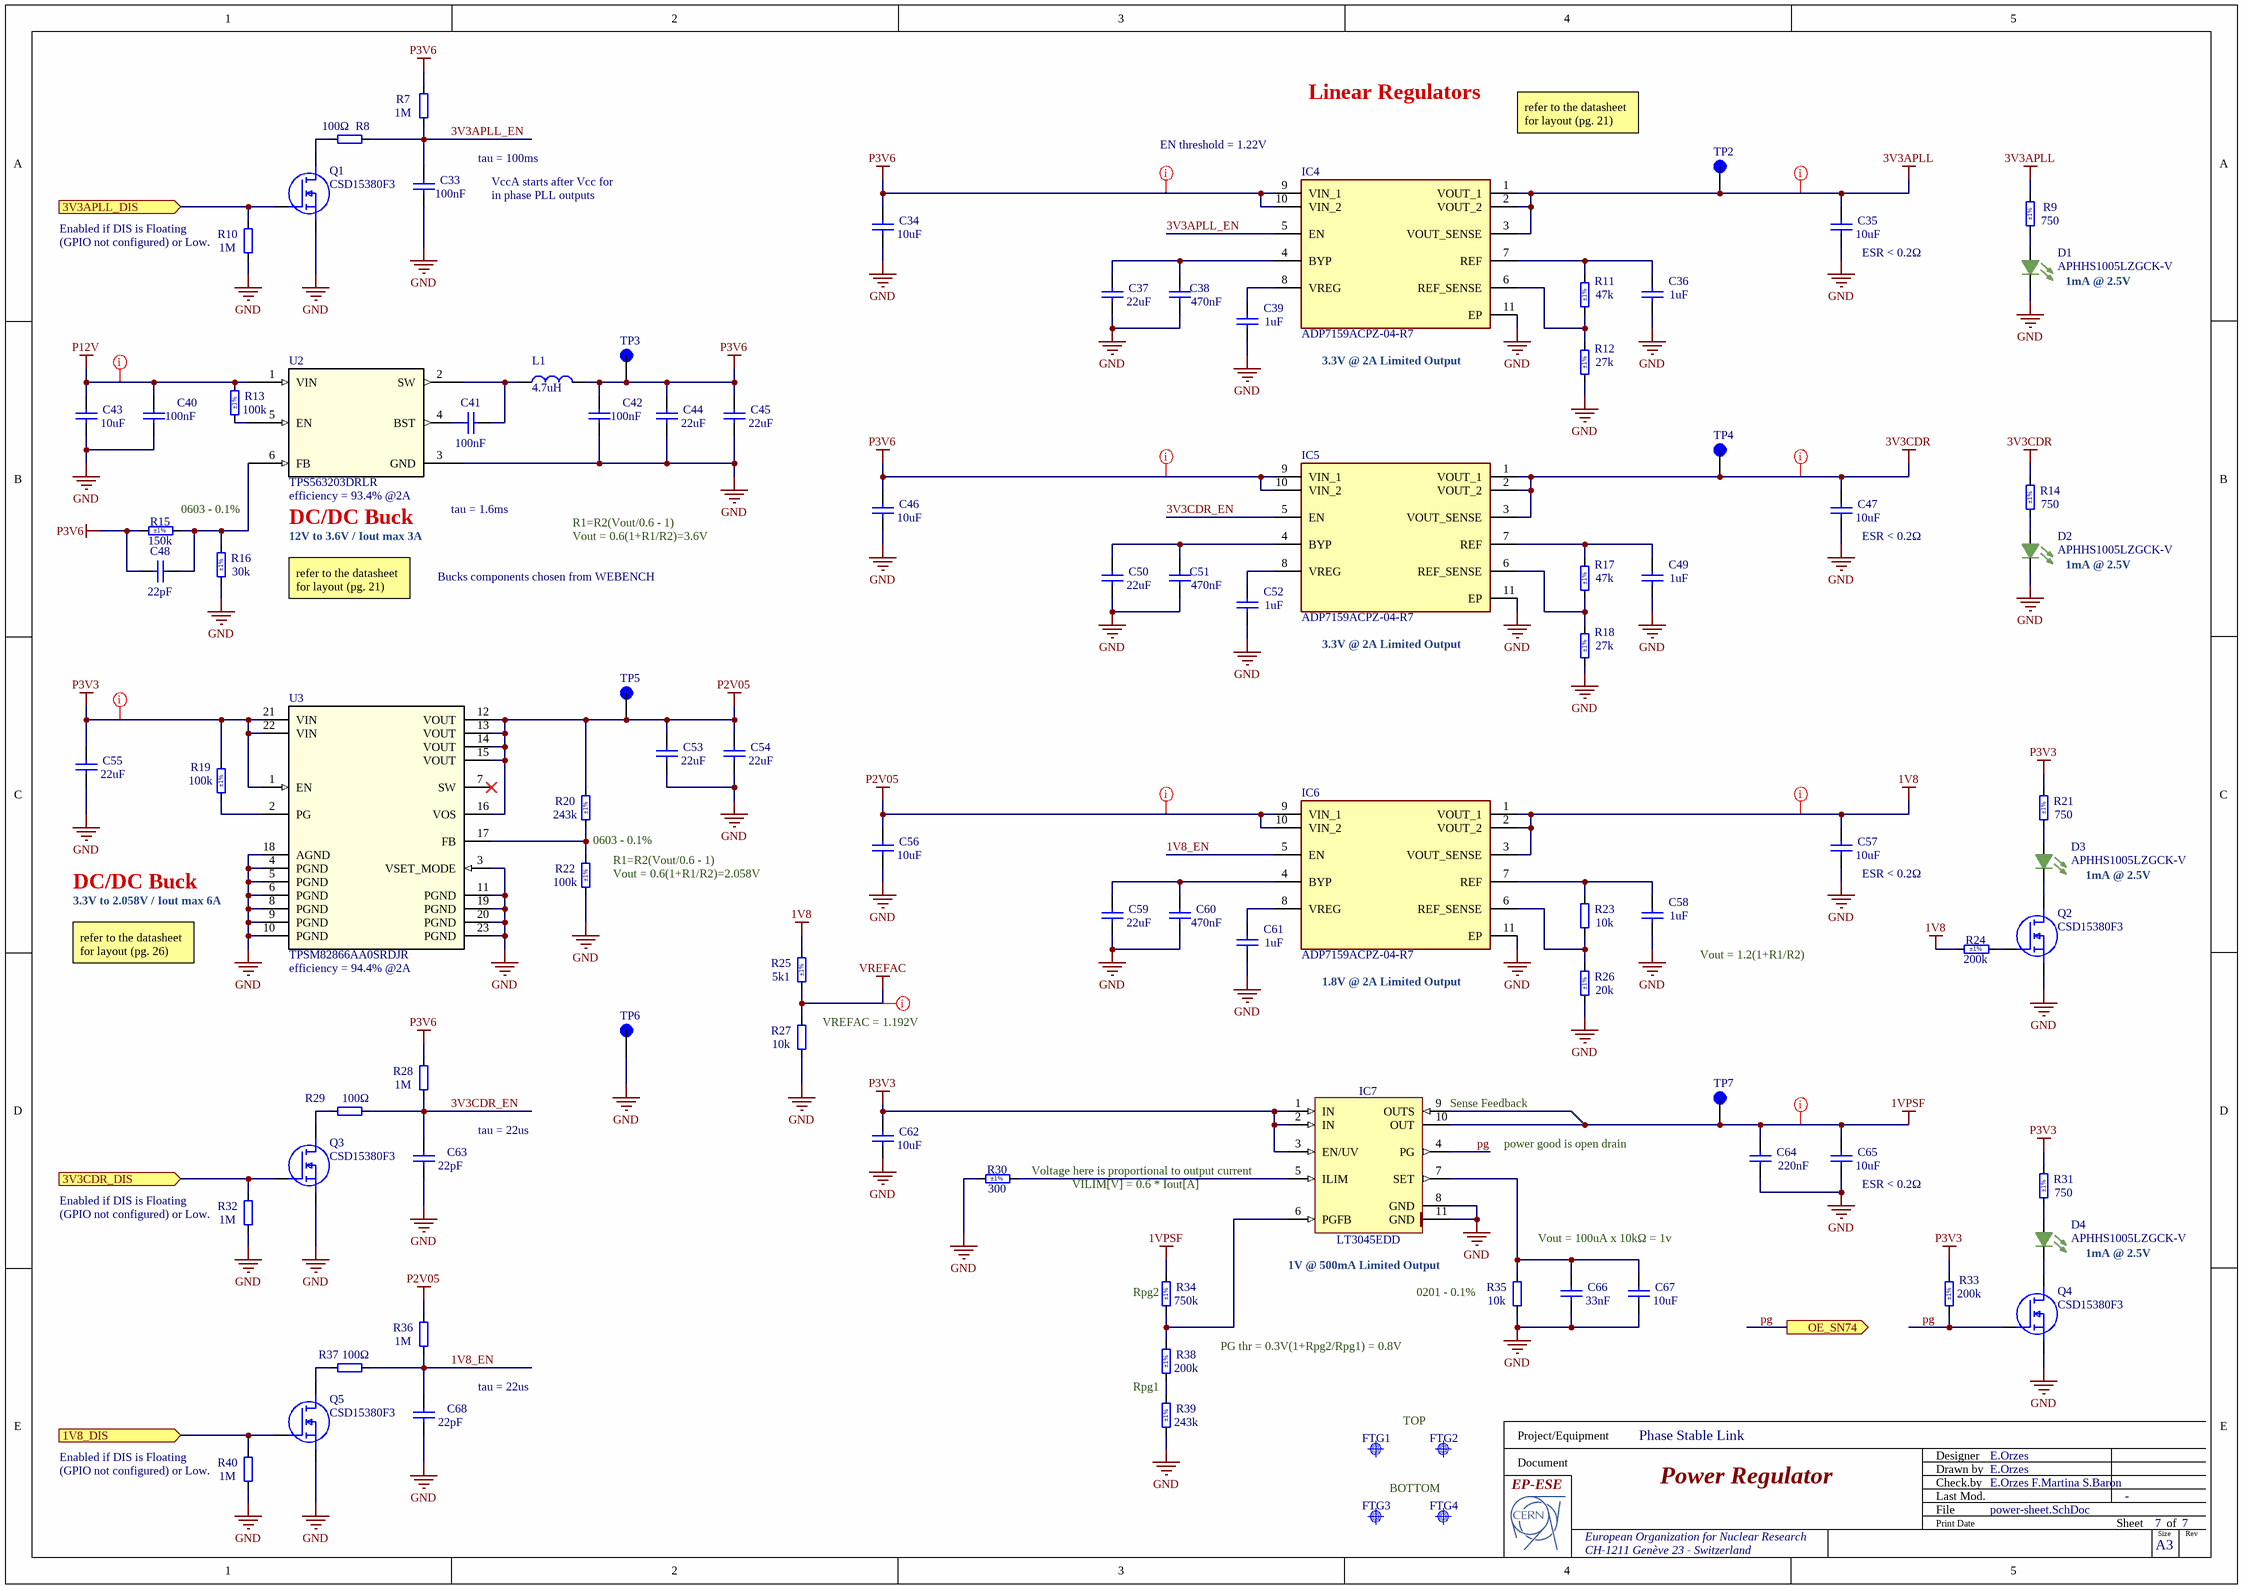
[diagram p2: power-sheet.SchDoc]

### Parts
(Parts that share a designator on the sheet are numbered #1, #2 ... from top to bottom, then left to right.)
C33  100nF  [MURATA_HI_DENSITY_0201]
C34  10uF  [CAPC1608X87N]
C35  10uF  [CAPC1608X87N]
C36  1uF  [CAPC1005X55N]
C37  22uF  [MURATA_HI_DENSITY_0402_CAP]
C38  470nF  [CAPC0510X04N]
C39  1uF  [CAPC1005X55N]
C40  100nF  [MURATA_HI_DENSITY_0402_CAP]
C41  100nF  [MURATA_HI_DENSITY_0402_CAP]
C42  100nF  [MURATA_HI_DENSITY_0402_CAP]
C43  10uF  [CAPC1608X87N]
C44  22uF  [MURATA_HI_DENSITY_0402_CAP]
C45  22uF  [MURATA_HI_DENSITY_0402_CAP]
C46  10uF  [CAPC1608X87N]
C47  10uF  [CAPC1608X87N]
C48  22pF  [MURATA_HI_DENSITY_0402_CAP]
C49  1uF  [CAPC1005X55N]
C50  22uF  [MURATA_HI_DENSITY_0402_CAP]
C51  470nF  [CAPC0510X04N]
C52  1uF  [CAPC1005X55N]
C53  22uF  [MURATA_HI_DENSITY_0402_CAP]
C54#1  22uF  [MURATA_HI_DENSITY_0402_CAP]
C55#1  22uF  [MURATA_HI_DENSITY_0402_CAP]
C56  10uF  [CAPC1608X87N]
C57  10uF  [CAPC1608X87N]
C58  1uF  [CAPC1005X55N]
C59  22uF  [MURATA_HI_DENSITY_0402_CAP]
C60  470nF  [CAPC0510X04N]
C61  1uF  [CAPC1005X55N]
C62  10uF  [CAPC1608X87N]
C63  22pF  [MURATA_HI_DENSITY_0402_CAP]
C64  220nF  [CAPC0603X33N]
C65  10uF  [CAPC1608X87N]
C66  33nF  [LLL03TR61E333KE01]
C67  10uF  [CAPC1608X87N]
C68  22pF  [MURATA_HI_DENSITY_0402_CAP]
D1  APHHS1005LZGCK-V  [LED_APHHS1005LZGCK-V]
D2  APHHS1005LZGCK-V  [LED_APHHS1005LZGCK-V]
D3  APHHS1005LZGCK-V  [LED_APHHS1005LZGCK-V]
D4  APHHS1005LZGCK-V  [LED_APHHS1005LZGCK-V]
FTG1  Use only in PCB  [FIDUCIAL_TOP_C100-200]  (value not drawn)
FTG2  Use only in PCB  [FIDUCIAL_TOP_C100-200]  (value not drawn)
FTG3  Use only in PCB  [FIDUCIAL_TOP_C100-200]  (value not drawn)
FTG4  Use only in PCB  [FIDUCIAL_TOP_C100-200]  (value not drawn)
IC4  ADP7159ACPZ-04-R7  [SON50P300X300X85-11N-D]
IC5  ADP7159ACPZ-04-R7  [SON50P300X300X85-11N-D]
IC6#1  ADP7159ACPZ-04-R7  [SON50P300X300X85-11N-D]
IC7  LT3045EDD  [SON50P300X300X80-11N-R175X248]
L1  4.7uH  [DFE322520FD1R0MP2]
Q1  CSD15380F3  [CSD15380F3]
Q2  CSD15380F3  [CSD15380F3]
Q3  CSD15380F3  [CSD15380F3]
Q4  CSD15380F3  [CSD15380F3]
Q5  CSD15380F3  [CSD15380F3]
R7  1M  [MURATA_HI_DENSITY_0201]
R8  100Ω  [MURATA_HI_DENSITY_0201]
R9  750  Tolerance: ±1%  [RESC1005X40N]
R10  1M  [MURATA_HI_DENSITY_0201]
R11  47k  Tolerance: ±1%  [RESC1005X40N]
R12  27k  Tolerance: ±1%  [RESC1005X40N]
R13  100k  Tolerance: ±1%  [RESC1608X55N]
R14  750  Tolerance: ±1%  [RESC1005X40N]
R15  150k  Tolerance: ±1%  [RESC1608X55N]
R16  30k  Tolerance: ±1%  [RESC1608X55N]
R17  47k  Tolerance: ±1%  [RESC1005X40N]
R18  27k  Tolerance: ±1%  [RESC1005X40N]
R19  100k  Tolerance: ±1%  [RESC1608X55N]
R20  243k  Tolerance: ±1%  [RESC1608X55N]
R21  750  Tolerance: ±1%  [RESC1005X40N]
R22  100k  Tolerance: ±1%  [RESC1608X55N]
R23  10k  [MURATA_HI_DENSITY_0201]
R24  200k  Tolerance: ±1%  [RESC1005X40N]
R25  5k1  Tolerance: ±1%  [RESC1005X40N]
R26  20k  Tolerance: ±1%  [RESC1005X40N]
R27  10k  [MURATA_HI_DENSITY_0201]
R28  1M  [MURATA_HI_DENSITY_0201]
R29  100Ω  [MURATA_HI_DENSITY_0201]
R30  300  Tolerance: ±1%  [RESC1005X40N]
R31  750  Tolerance: ±1%  [RESC1005X40N]
R32  1M  [MURATA_HI_DENSITY_0201]
R33  200k  Tolerance: ±1%  [RESC1005X40N]
R34  750k  Tolerance: ±1%  [RESC1005X40N]
R35  10k  [RESC0603X28N]
R36  1M  [MURATA_HI_DENSITY_0201]
R37  100Ω  [MURATA_HI_DENSITY_0201]
R38  200k  Tolerance: ±1%  [RESC1005X40N]
R39  243k  Tolerance: ±1%  [RESC1608X55N]
R40  1M  [MURATA_HI_DENSITY_0201]
TP2  RCU-0C  [TP+195X110]  (value not drawn)
TP3  RCU-0C  [TP+195X110]  (value not drawn)
TP4  RCU-0C  [TP+195X110]  (value not drawn)
TP5  RCU-0C  [TP+195X110]  (value not drawn)
TP6  RCU-0C  [TP+195X110]  (value not drawn)
TP7  RCU-0C  [TP+195X110]  (value not drawn)
U2  TPS563203DRLR  [SOT_07SDRLR_TEX]
U3  TPSM82866AA0SRDJR  [RDJ0023A-MFG]

### Ports
1V8_DIS (in), 3V3APLL_DIS (in), 3V3CDR_DIS (in), OE_SN74 (out)

### Nets
1V8: C57.2 IC6#1.1(VOUT_1) IC6#1.2(VOUT_2) IC6#1.3(VOUT_SENSE) R24.1 R25.2
1VPSF: C64.2 C65.2 IC7.9(OUTS) IC7.10(OUT) R34.2 TP7.1(TP)
3V3APLL: C35.2 IC4.1(VOUT_1) IC4.2(VOUT_2) IC4.3(VOUT_SENSE) R9.2 TP2.1(TP)
3V3CDR: C47.2 IC5.1(VOUT_1) IC5.2(VOUT_2) IC5.3(VOUT_SENSE) R14.2 TP4.1(TP)
GND: C33.1 C34.1 C35.1 C36.1 C37.1 C38.1 C39.1 C40.2 C42.2 C43.1 C44.1 C45.1 C46.1 C47.1 C49.1 C50.1 C51.1 C52.1 C53.1 C54#1.1 C55#1.1 C56.1 C57.1 C58.1 C59.1 C60.1 C61.1 C62.1 C63.2 C64.1 C65.1 C66.1 C67.1 C68.2 D1.1(C) D2.1(C) IC4.11(EP) IC5.11(EP) IC6#1.11(EP) IC7.8(GND) IC7.11(GND) Q1.2(S) Q2.2(S) Q3.2(S) Q4.2(S) Q5.2(S) R10.1 R12.1 R16.1 R18.1 R22.1 R26.1 R27.1 R30.1 R32.1 R35.1 R39.1 R40.1 TP6.1(TP) U2.3(GND) U3.3(VSET_MODE) U3.4(PGND) U3.5(PGND) U3.6(PGND) U3.8(PGND) U3.9(PGND) U3.10(PGND) U3.11(PGND) U3.18(AGND) U3.19(PGND) U3.20(PGND) U3.23(PGND)
P2V05: C53.2 C54#1.2 C56.2 IC6#1.9(VIN_1) IC6#1.10(VIN_2) R20.2 R36.2 TP5.1(TP) U3.12(VOUT) U3.13(VOUT) U3.14(VOUT) U3.15(VOUT) U3.16(VOS)
P3V3: C55#1.2 C62.2 IC7.1(IN) IC7.2(IN) IC7.3(EN/UV) R19.2 R21.2 R31.2 R33.2 U3.1(EN) U3.21(VIN) U3.22(VIN)
P3V6: C34.2 C42.1 C44.2 C45.2 C46.2 C48.2 IC4.9(VIN_1) IC4.10(VIN_2) IC5.9(VIN_1) IC5.10(VIN_2) L1.2 R7.2 R15.1 R28.2 TP3.1(TP)
P12V: C40.1 C43.2 R13.2 U2.1(VIN)
VREFAC: R25.1 R27.2
1V8_DIS: Q5.1(G) R40.2 ; port 1V8_DIS
1V8_EN: C68.1 IC6#1.5(EN) R36.1 R37.2
3V3_APLL_DIS: Q1.1(G) R10.2 ; port 3V3APLL_DIS
3V3_CDR_DIS: Q3.1(G) R32.2 ; port 3V3CDR_DIS
3V3APLL_EN: C33.2 IC4.5(EN) R7.1 R8.2
3V3CDR_EN: C63.1 IC5.5(EN) R28.1 R29.2
pg: IC7.4(PG) Q4.1(G) R33.1 ; port OE_SN74  [project net OE_SN74]
NetC36_2: C36.2 IC4.7(REF) R11.2
NetC37_2: C37.2 C38.2 IC4.4(BYP)
NetC39_2: C39.2 IC4.8(VREG)
NetC41_1: C41.1 L1.1 U2.2(SW)
NetC41_2: C41.2 U2.4(BST)
NetC48_1: C48.1 R15.2 R16.2 U2.6(FB)
NetC49_2: C49.2 IC5.7(REF) R17.2
NetC50_2: C50.2 C51.2 IC5.4(BYP)
NetC52_2: C52.2 IC5.8(VREG)
NetC58_2: C58.2 IC6#1.7(REF) R23.2
NetC59_2: C59.2 C60.2 IC6#1.4(BYP)
NetC61_2: C61.2 IC6#1.8(VREG)
NetC66_2: C66.2 C67.2 IC7.7(SET) R35.2
NetD1_2: D1.2(A) R9.1
NetD2_2: D2.2(A) R14.1
NetD3_1: D3.1(C) Q2.3(D)
NetD3_2: D3.2(A) R21.1
NetD4_1: D4.1(C) Q4.3(D)
NetD4_2: D4.2(A) R31.1
NetIC4_6: IC4.6(REF_SENSE) R11.1 R12.2
NetIC5_6: IC5.6(REF_SENSE) R17.1 R18.2
NetIC6#1_6: IC6#1.6(REF_SENSE) R23.1 R26.2
NetIC7_5: IC7.5(ILIM) R30.2
NetIC7_6: IC7.6(PGFB) R34.1 R38.2
NetQ1_3: Q1.3(D) R8.1
NetQ2_1: Q2.1(G) R24.2
NetQ3_3: Q3.3(D) R29.1
NetQ5_3: Q5.3(D) R37.1
NetR13_1: R13.1 U2.5(EN)
NetR19_1: R19.1 U3.2(PG)
NetR20_1: R20.1 R22.2 U3.17(FB)
NetR38_1: R38.1 R39.2

Not connected (* = marked no-connect by the designer): U3 7(SW)*

### Layout directives
net class Power: 1V8, 1VPSF, 3V3APLL, 3V3CDR, P2V05, P3V3, P3V6, P12V, VREFAC

### Notes on the sheet
- Linear Regulators
- refer to the datasheet for layout (pg. 21)
- tau = 100ms
- (near IC4) EN threshold = 1.22V
- (near R10) Enabled if DIS is Floating (GPIO not configured) or Low.
- VccA starts after Vcc for in phase PLL outputs
- (near C35) ESR < 0.2Ω
- 1mA @ 2.5V
- (near IC4) 3.3V @ 2A Limited Output
- (near R15) 0603 - 0.1%
- (near U2) DC/DC Buck
- (near U2) efficiency = 93.4% @2A
- (near U2) tau = 1.6ms
- R1=R2(Vout/0.6 - 1)
- 12V to 3.6V / Iout max 3A
- Bucks components chosen from WEBENCH
- Vout = 0.6(1+R1/R2)=3.6V
- (near C47) ESR < 0.2Ω
- (near IC5) 3.3V @ 2A Limited Output
- 0603 - 0.1%
- DC/DC Buck
- (near U3) 3.3V to 2.058V / Iout max 6A
- (near R22) Vout = 0.6(1+R1/R2)=2.058V
- (near C57) ESR < 0.2Ω
- refer to the datasheet for layout (pg. 26)
- (near U3) efficiency = 94.4% @2A
- (near IC6#1) 1.8V @ 2A Limited Output
- Vout = 1.2(1+R1/R2)
- (near R27) VREFAC = 1.192V
- tau = 22us
- (near IC7) Sense Feedback
- (near IC7) Voltage here is proportional to output current
- VILIM[V] = 0.6 * Iout[A]
- power good is open drain
- (near C65) ESR < 0.2Ω
- (near R32) Enabled if DIS is Floating (GPIO not configured) or Low.
- (near IC7) 1V @ 500mA Limited Output
- Vout = 100uA x 10kΩ = 1v
- (near R34) Rpg2
- (near R35) 0201 - 0.1%
- Rpg1
- PG thr = 0.3V(1+Rpg2/Rpg1) = 0.8V
- TOP
- (near R40) Enabled if DIS is Floating (GPIO not configured) or Low.
- BOTTOM
- Project/Equipment
- Document
- Designer
- Drawn by
- Check.by
- File
- Last Mod.
- Print Date
- Sheet
- Size
- A3
- of
- Rev

### Library data of the parts
C33 = C0201-100nF-high-density: GRM033R61C104KE14; Vmax: 16V; Value: 100nF
C34 C35 C43 C46 C47 C56 C57 C62 C65 C67 = CC0603_10UF_6.3V_20%_X5R: as C3 on sheet lane; Part Number: CC0603_10UF_6.3V_20%_X5R; Component Kind: Standard; Component Type: Standard; Pin Count: 2; Value: 10uF; Status: Preferred; Manufacturer Part Number: CC0603_10uF_6.3V_20%_X5R; Case: 0603; Mounted: Yes; Socket: No; SMD: Yes; Sense: No; Manufacturer1 Example: KEMET; Manufacturer1 ComponentHeight: 0.95mm; HelpURL: \\cern.ch\dfs\Applications\Altium\Datasheets\CC0603_X5R_KEMET.pdf; Author: CERN DEM JLC; CreateDate: 03/12/2007; LatestRevisionDate: 03/12/2007
C36 C39 C49 C52 C58 C61 = CC0402_1UF_16V_10%_X5R: GRM153B30J105ME15; Part Description: SMD Multilayer Chip Ceramic Capacitor; Manufacturer: GENERIC; Manufacturer1 Part Number: C1005X5R1C105KT; Voltage: 16V; TC: X5R; Tolerance: ±10%; Part Number: CC0402_1UF_16V_10%_X5R; Component Kind: Standard; Component Type: Standard; Pin Count: 2; Value: 1uF; Status: Preferred; Manufacturer Part Number: CC0402_1UF_16V_10%_X5R; Case: 0402; Mounted: Yes; Socket: No; SMD: Yes; Sense: No; Manufacturer1 Example: TDK; Manufacturer1 ComponentHeight: 0.55mm; HelpURL: \\cern.ch\dfs\Applications\Altium\Datasheets\CC0402_X5R_TDK_C.pdf; Author: CERN DEM JLC; CreateDate: 10/25/2012; LatestRevisionDate: 10/25/2012
C37 C44 C45 C50 C53 C54#1 C55#1 C59 = C0402-22uF-high-density: GRM155R60J226ME11; Vmax: 6.3V; Value: 22uF
C38 C51 C60 = Capacitor - non polarized: LLL153C70G474ME17; Value: 470nF
C40-C42 = C0402-22uF-high-density: GRM155R71E104KE14; Value: 22uF; Vmax: 6.3V
C48 C63 C68 = C0402-22uF-high-density: C0402C220J4GACTU; Value: 22uF; Vmax: 6.3V
C64 = CC0201_220NF_6.3V_10%_X7S_TDK_C0603X7S0J224K030: GRM033C80J224KE90D; Part Description: SMD Multilayer Chip Ceramic Capacitor; Manufacturer: TDK; Voltage: 6.3V; TC: X7S; Tolerance: ±10%; Part Number: CC0201_220NF_6.3V_10%_X7S_TDK_C0603X7S0J224K030; Component Kind: Standard; Component Type: Standard; Pin Count: 2; Value: 220nF; Status: Not Recommended; Manufacturer Part Number: C0603X7S0J224K030; Case: 0201; Mounted: Yes; Socket: No; SMD: Yes; Sense: No; ComponentHeight: 0.33mm; HelpURL: \\cern.ch\dfs\Applications\Altium\Datasheets\CC0201_X7S_TDK_C.pdf; Author: CERN DEM BC; CreateDate: 11/25/2020; LatestRevisionDate: 11/25/2020
C66 = Capacitor - non polarized: LLL03TR61E333KE01; Value: 33nF
D1-D4 = APHHS1005LZGCK-V: Led Green 0402 2mA 2.65V 40mcd 102mW; MF: Kingbright Corporation; SnapEDA_Link: https://www.snapeda.com/parts/APHHS1005LZGCK-V/Kingbright/view-part/?ref=snap; Package: 0402 Kingbright Corporation; Value: *; MP: APHHS1005LZGCK-V; Check_prices: https://www.snapeda.com/parts/APHHS1005LZGCK-V/Kingbright/view-part/?ref=eda
FTG1-FTG4 = FIDUCIAL_TARGET_C100-200: Fiducial Target; Part Description: Round Fiducial Target, Top Layer, 1.0mm, Top Solder 2.0mm, Keepout =2.0mm; Mounted: No; Part Number: FIDUCIAL_TARGET_C100-200; Component Kind: Standard (No BOM); Component Type: Standard (No BOM); Pin Count: 1; Family: Fiducial; Socket: No; SMD: Yes; Sense: No; Status: None; ComponentHeight: 0mm; HelpURL: Undefined; Author: CERN DEM JLC; CreateDate: 09/02/2010; LatestRevisionDate: 04/04/2012; PackageDescription: Round Fiducial Target, Top Layer, 1.0mm, Top Solder 2.0mm, Keepout =2.0mm
IC4 IC5 IC6#1 = ADP7159ACPZ-04-R7: Integrated Circuit; Manufacturer_Name: Analog Devices; Datasheet Link: https://www.analog.com/media/en/technical-documentation/data-sheets/ADP7159.pdf; Height: 0.85mm; Manufacturer_Part_Number: ADP7159ACPZ-04-R7; Mouser Part Number: 584-ADP7159ACPZ04R7; Mouser Price/Stock: https://www.mouser.co.uk/ProductDetail/Analog-Devices/ADP7159ACPZ-04-R7?qs=JeIcUl65ClBXEAZRPtHUVQ%3D%3D; Arrow Part Number: ADP7159ACPZ-04-R7; Arrow Price/Stock: https://www.arrow.com/en/products/adp7159acpz-04-r7/analog-devices
IC7 = LT3045EDD#PBF: 20V, 500mA, Ultralow Noise, Ultrahigh PSRR Linear Regulator; Manufacturer: LINEAR TECHNOLOGY; PressFit: No; Bonding: No; Part Number: LT3045EDD#PBF; Component Kind: Standard; Component Type: Standard; Device: LT3045EDD; PackageDescription: SON, 0.50mm Pitch; 10 Pin, 3.00mm W X 3.00mm L X 0.80mm H body (w/Thermal Tab 1.75 X 2.48 mm), IPC Medium Density; Part Description: 20V, 500mA, Ultralow Noise, Ultrahigh PSRR Linear Regulator; Manufacturer Part Number: LT3045EDD; Pin Count: 11; Case: SON10; Mounted: Yes; Socket: No; SMD: Yes; Sense: No; ComponentHeight: 0.8mm; HelpURL: \\cern.ch\dfs\Applications\Altium\Datasheets\LT3045EDD#PBF.pdf; Author: CERN DEM JLC; CreateDate: 07/12/2016; LatestRevisionDate: 03/02/2022
L1 = DFE322520FD-4R7M=P2: Inductor; Manufacturer_Name: Murata Electronics; Datasheet Link: https://search.murata.co.jp/Ceramy/image/img/P02/J(E)TE243A-9104.pdf; Height: 2mm; Manufacturer_Part_Number: DFE322520FD-4R7M=P2; Mouser Part Number: 81-DFE322520FD4R7MP2; Mouser Price/Stock: https://www.mouser.co.uk/ProductDetail/Murata-Electronics/DFE322520FD-4R7M%3dP2?qs=17u8i%2FzlE8%252BgAY54mivQ1g%3D%3D; Arrow Part Number: DFE322520FD-4R7M=P2; Arrow Price/Stock: https://www.arrow.com/en/products/dfe322520fd-4r7mp2/murata-manufacturing?region=nac
Q1-Q5 = CSD15380F3: MOSFET (N-Channel); Manufacturer_Name: Texas Instruments; Datasheet Link: https://www.ti.com/lit/ds/symlink/csd15380f3.pdf?ts=1641221366106&ref_url=https%253A%252F%252Fwww.google.com%252F; Height: 0.35mm; Manufacturer_Part_Number: CSD15380F3; Mouser Part Number: 595-CSD15380F3; Mouser Price/Stock: https://www.mouser.co.uk/ProductDetail/Texas-Instruments/CSD15380F3?qs=zEmsApcVOkXP46xhm0edmA%3D%3D; Arrow Part Number: CSD15380F3; Arrow Price/Stock: https://www.arrow.com/en/products/csd15380f3/texas-instruments?region=nac
R7 R10 R28 R32 R36 R40 = R0201-100ohm-high-density: Resistor 1M; Value: 100Ω
R8 R29 R37 = R0201-100ohm-high-density: Resistor; Value: 100Ω
R9 R14 R21 R31 = R0402_750R_1%_0.0625W_100PPM: Resistor - 1%; Part Description: General Purpose Thick Film Chip Resistor; Manufacturer: GENERIC; Manufacturer1 Part Number: 232270677501L; TC: ±100ppm/°C; PressFit: No; Part Number: R0402_750R_1%_0.0625W_100PPM; Component Kind: Standard; Component Type: Standard; Pin Count: 2; Value: 750; Status: Not Recommended; Power: 0.0625W; Manufacturer Part Number: R0402_750R_1%_0.0625W_100PPM; Case: 0402; Mounted: Yes; Sense: No; Socket: No; SMD: Yes; Manufacturer1 Example: YAGEO PHYCOMP; Manufacturer1 ComponentHeight: 0.4mm; HelpURL: \\cern.ch\dfs\Applications\Altium\Datasheets\R0402_Phycomp_RC0402.pdf; Author: CERN DEM JLC; CreateDate: 12/3/2007; LatestRevisionDate: 10/17/2012
R11 R17 = R0402_47K_1%_0.0625W_100PPM: Resistor - 1%; Part Description: General Purpose Thick Film Chip Resistor; Manufacturer: GENERIC; Manufacturer1 Part Number: 232270674703L; TC: ±100ppm/°C; PressFit: No; Part Number: R0402_47K_1%_0.0625W_100PPM; Component Kind: Standard; Component Type: Standard; Pin Count: 2; Value: 47k; Status: Not Recommended; Power: 0.0625W; Manufacturer Part Number: R0402_47K_1%_0.0625W_100PPM; Case: 0402; Mounted: Yes; Sense: No; Socket: No; SMD: Yes; Manufacturer1 Example: YAGEO PHYCOMP; Manufacturer1 ComponentHeight: 0.4mm; HelpURL: \\cern.ch\dfs\Applications\Altium\Datasheets\R0402_Phycomp_RC0402.pdf; Author: CERN DEM JLC; CreateDate: 12/3/2007; LatestRevisionDate: 10/17/2012
R12 R18 = R0402_27K_1%_0.0625W_100PPM: Resistor - 1%; Part Description: General Purpose Thick Film Chip Resistor; Manufacturer: GENERIC; Manufacturer1 Part Number: 232270672703L; TC: ±100ppm/°C; PressFit: No; Part Number: R0402_27K_1%_0.0625W_100PPM; Component Kind: Standard; Component Type: Standard; Pin Count: 2; Value: 27k; Status: Not Recommended; Power: 0.0625W; Manufacturer Part Number: R0402_27K_1%_0.0625W_100PPM; Case: 0402; Mounted: Yes; Sense: No; Socket: No; SMD: Yes; Manufacturer1 Example: YAGEO PHYCOMP; Manufacturer1 ComponentHeight: 0.4mm; HelpURL: \\cern.ch\dfs\Applications\Altium\Datasheets\R0402_Phycomp_RC0402.pdf; Author: CERN DEM JLC; CreateDate: 12/3/2007; LatestRevisionDate: 10/17/2012
R13 R19 R20 R22 R39 = R0603_30K_1%_0.1W_100PPM: Resistor - 1%; Part Description: General Purpose Thick Film Chip Resistor; Manufacturer: GENERIC; Manufacturer1 Part Number: NRC06F3002TRF; Value: 30k; Power: 0.1W; TC: ±100ppm/°C; PressFit: No; Part Number: R0603_30K_1%_0.1W_100PPM; Component Kind: Standard; Component Type: Standard; Pin Count: 2; Status: Preferred; Manufacturer Part Number: R0603_30K_1%_0.1W_100PPM; Case: 0603; Mounted: Yes; Sense: No; Socket: No; SMD: Yes; Manufacturer1 Example: NIC COMPONENT; Manufacturer1 ComponentHeight: 0.55mm; HelpURL: \\cern.ch\dfs\Applications\Altium\Datasheets\R0603_NIC_NRC.pdf; Author: CERN DEM JLC; CreateDate: 12/3/2007; LatestRevisionDate: 3/13/2008
R15 = R0603_150K_1%_0.1W_100PPM: Resistor - 1%; Part Description: General Purpose Thick Film Chip Resistor; Manufacturer: GENERIC; Manufacturer1 Part Number: NRC06F1503TRF; Power: 0.1W; TC: ±100ppm/°C; PressFit: No; Part Number: R0603_150K_1%_0.1W_100PPM; Component Kind: Standard; Component Type: Standard; Pin Count: 2; Value: 150k; Status: Preferred; Manufacturer Part Number: R0603_150K_1%_0.1W_100PPM; Case: 0603; Mounted: Yes; Sense: No; Socket: No; SMD: Yes; Manufacturer1 Example: NIC COMPONENT; Manufacturer1 ComponentHeight: 0.55mm; HelpURL: \\cern.ch\dfs\Applications\Altium\Datasheets\R0603_NIC_NRC.pdf; Author: CERN DEM JLC; CreateDate: 12/3/2007; LatestRevisionDate: 3/13/2008
R16 = R0603_30K_1%_0.1W_100PPM: Resistor - 1%; Part Description: General Purpose Thick Film Chip Resistor; Manufacturer: GENERIC; Manufacturer1 Part Number: NRC06F3002TRF; Power: 0.1W; TC: ±100ppm/°C; PressFit: No; Part Number: R0603_30K_1%_0.1W_100PPM; Component Kind: Standard; Component Type: Standard; Pin Count: 2; Value: 30k; Status: Preferred; Manufacturer Part Number: R0603_30K_1%_0.1W_100PPM; Case: 0603; Mounted: Yes; Sense: No; Socket: No; SMD: Yes; Manufacturer1 Example: NIC COMPONENT; Manufacturer1 ComponentHeight: 0.55mm; HelpURL: \\cern.ch\dfs\Applications\Altium\Datasheets\R0603_NIC_NRC.pdf; Author: CERN DEM JLC; CreateDate: 12/3/2007; LatestRevisionDate: 3/13/2008
R23 R27 = R0201-100ohm-high-density: Resistor 10k; Value: 100Ω
R24 R33 R38 = R0402_200K_1%_0.0625W_100PPM: Resistor - 1%; Part Description: General Purpose Thick Film Chip Resistor; Manufacturer: GENERIC; Manufacturer1 Part Number: 232270672004L; TC: ±100ppm/°C; PressFit: No; Part Number: R0402_200K_1%_0.0625W_100PPM; Component Kind: Standard; Component Type: Standard; Pin Count: 2; Value: 200k; Status: Not Recommended; Power: 0.0625W; Manufacturer Part Number: R0402_200K_1%_0.0625W_100PPM; Case: 0402; Mounted: Yes; Sense: No; Socket: No; SMD: Yes; Manufacturer1 Example: YAGEO PHYCOMP; Manufacturer1 ComponentHeight: 0.4mm; HelpURL: \\cern.ch\dfs\Applications\Altium\Datasheets\R0402_Phycomp_RC0402.pdf; Author: CERN DEM JLC; CreateDate: 12/3/2007; LatestRevisionDate: 10/17/2012
R25 = R0402_5K1_1%_0.0625W_100PPM: Resistor - 1%; Part Description: General Purpose Thick Film Chip Resistor; Manufacturer: GENERIC; Manufacturer1 Part Number: 232270675102L; TC: ±100ppm/°C; PressFit: No; Part Number: R0402_5K1_1%_0.0625W_100PPM; Component Kind: Standard; Component Type: Standard; Pin Count: 2; Value: 5k1; Status: Not Recommended; Power: 0.0625W; Manufacturer Part Number: R0402_5K1_1%_0.0625W_100PPM; Case: 0402; Mounted: Yes; Sense: No; Socket: No; SMD: Yes; Manufacturer1 Example: YAGEO PHYCOMP; Manufacturer1 ComponentHeight: 0.4mm; HelpURL: \\cern.ch\dfs\Applications\Altium\Datasheets\R0402_Phycomp_RC0402.pdf; Author: CERN DEM JLC; CreateDate: 03/12/2007; LatestRevisionDate: 17/10/2012
R26 = R0402_20K_1%_0.0625W_100PPM: Resistor - 1%; Part Description: General Purpose Thick Film Chip Resistor; Manufacturer: GENERIC; Manufacturer1 Part Number: 232270672003L; TC: ±100ppm/°C; PressFit: No; Part Number: R0402_20K_1%_0.0625W_100PPM; Component Kind: Standard; Component Type: Standard; Pin Count: 2; Value: 20k; Status: Not Recommended; Power: 0.0625W; Manufacturer Part Number: R0402_20K_1%_0.0625W_100PPM; Case: 0402; Mounted: Yes; Sense: No; Socket: No; SMD: Yes; Manufacturer1 Example: YAGEO PHYCOMP; Manufacturer1 ComponentHeight: 0.4mm; HelpURL: \\cern.ch\dfs\Applications\Altium\Datasheets\R0402_Phycomp_RC0402.pdf; Author: CERN DEM JLC; CreateDate: 12/3/2007; LatestRevisionDate: 10/17/2012
R30 = R0402_300R_1%_0.0625W_100PPM: Resistor - 1%; Part Description: General Purpose Thick Film Chip Resistor; Manufacturer: GENERIC; Manufacturer1 Part Number: 232270673001L; TC: ±100ppm/°C; PressFit: No; Part Number: R0402_300R_1%_0.0625W_100PPM; Component Kind: Standard; Component Type: Standard; Pin Count: 2; Value: 300; Status: Not Recommended; Power: 0.0625W; Manufacturer Part Number: R0402_300R_1%_0.0625W_100PPM; Case: 0402; Mounted: Yes; Sense: No; Socket: No; SMD: Yes; Manufacturer1 Example: YAGEO PHYCOMP; Manufacturer1 ComponentHeight: 0.4mm; HelpURL: \\cern.ch\dfs\Applications\Altium\Datasheets\R0402_Phycomp_RC0402.pdf; Author: CERN DEM JLC; CreateDate: 03/12/2007; LatestRevisionDate: 17/10/2012
R34 = R0402_750K_1%_0.0625W_100PPM: Resistor - 1%; Part Description: General Purpose Thick Film Chip Resistor; Manufacturer: GENERIC; Manufacturer1 Part Number: 232270677504L; TC: ±100ppm/°C; PressFit: No; Part Number: R0402_750K_1%_0.0625W_100PPM; Component Kind: Standard; Component Type: Standard; Pin Count: 2; Value: 750k; Status: Not Recommended; Power: 0.0625W; Manufacturer Part Number: R0402_750K_1%_0.0625W_100PPM; Case: 0402; Mounted: Yes; Sense: No; Socket: No; SMD: Yes; Manufacturer1 Example: YAGEO PHYCOMP; Manufacturer1 ComponentHeight: 0.4mm; HelpURL: \\cern.ch\dfs\Applications\Altium\Datasheets\R0402_Phycomp_RC0402.pdf; Author: CERN DEM JLC; CreateDate: 03/12/2007; LatestRevisionDate: 17/10/2012
R35 = R0201_0R_JUMPER: Resistor; Part Description: 1A (0.05R Max DC Resistance) Zero Ohm Jumper; Manufacturer: GENERIC; Manufacturer1 Part Number: CRCW02010000Z0ED; Value: 0; PressFit: No; Part Number: R0201_0R_JUMPER; Component Kind: Standard; Component Type: Standard; Pin Count: 2; Status: Not Recommended; Manufacturer Part Number: R0201_0R_JUMPER; Case: 0201; Mounted: Yes; Sense: No; Socket: No; SMD: Yes; Manufacturer1 Example: VISHAY; Manufacturer1 ComponentHeight: 0.27mm; HelpURL: \\cern.ch\dfs\Applications\Altium\Datasheets\R0201_VISHAY_CRCW e3.pdf; Author: CERN DEM JLC; CreateDate: 19/11/2014; LatestRevisionDate: 08/01/2015
TP2-TP7 = RCU-0C: as TP1 on sheet lane; Package: None; Price: None; Value: *; MP: RCU-0C; Availability: Unavailable
U2 = TPS563203DRLR: No Description Available; Mfr_Name: Texas Instruments; Type: Power Management; RefDes: RefDes
U3 = XPSM82866AA0SRDJR: No Description Available; Mfr_Name: Texas Instruments; TYPE: TYPE; RefDes: RefDes